# Altium schematic sheet 3V3 voltage regulato.SchDoc
size A4
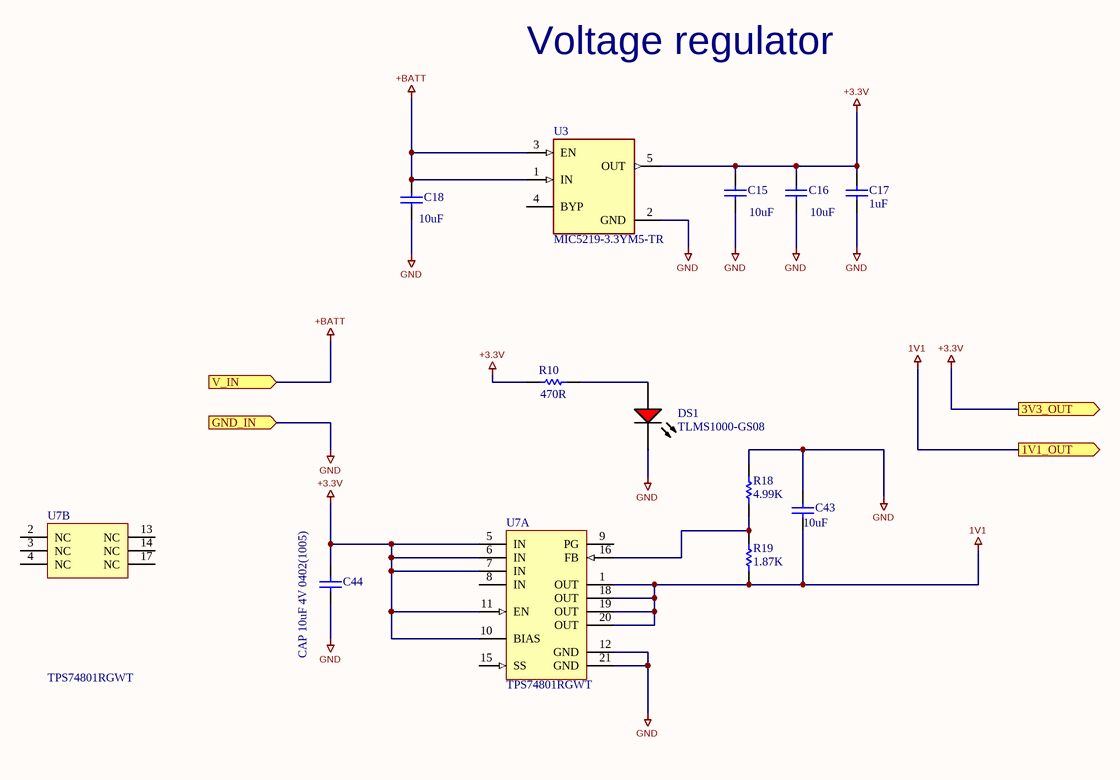
[diagram p0: 3V3 voltage regulato.SchDoc]

## Parts
C15  10uF  [CAPC1608X90X35NL10T15]
C16  10uF  [CAPC1608X90X35NL10T15]
C17  1uF  [CAPC1608X90X35LL10T15]
C18  10uF  [CAPC1608X90X35NL10T15]
C43  10uF  [CAPC0402(1005)60_L]
C44  CAP 10uF 4V 0402(1005)  [CAPC0402(1005)60_L]
DS1  TLMS1000-GS08  [VISH-TLMS1000_V]
R10  470R  [RESC1608X55X25LL10T15]
R18  4.99K  [RESC0402(1005)_N]
R19  1.87K  [RESC0402(1005)_N]
U3  MIC5219-3.3YM5-TR  [FP-SOT23-5LD-PL-1-IPC_C]
U7  TPS74801RGWT  [RGW0020A_V]  (parts A,B of 2)

## Ports
1V1_OUT (out), 3V3_OUT (out), GND_IN (in), V_IN (in)

## Nets
1V1: C43.1 R19.1 U7.1(OUT) U7.18(OUT) U7.19(OUT) U7.20(OUT) ; port 1V1_OUT
+3.3V: C15.2 C16.2 C17.2 C44.2 R10.1 U3.5(OUT) U7.5(IN) U7.6(IN) U7.7(IN) U7.10(BIAS) U7.11(EN) ; port 3V3_OUT
+BATT: C18.2 U3.1(IN) U3.3(EN) ; port V_IN
GND: C15.1 C16.1 C17.1 C18.1 C43.2 C44.1 DS1.2(K) R18.2 U3.2(GND) U7.12(GND) U7.21(GND) ; port GND_IN
NetDS1_1: DS1.1(A) R10.2
NetR18_1: R18.1 R19.2 U7.16(FB)

Not connected (* = marked no-connect by the designer): U3 4(BYP); U7 2(NC) 3(NC) 4(NC) 8(IN) 9(PG) 13(NC) 14(NC) 15(SS) 17(NC)

## Notes on the sheet
- Voltage regulator

## Library data of the parts
C15 C16 C18 = CMP-2006-02792-1: Part Number: GRM188R60J106ME47D; Manufacturer: Murata
C17 = CMP-2006-02459-1: Manufacturer: Murata; Part Number: GRM188R61E105KA12D
C43 C44 = CMP-1034-02139-1: CAP 10uF 4V ±20% 0402 (1005 Metric) Thickness 0.6mm SMD; Tolerance: Â±20%; Case-EIA: 0402; Case-Metric: 1005; Value: 10uF; Technology: SMT; Max Thickness: 0.6 mm; Rated Voltage: 4 V
DS1 = CMP-2000-07254-1: Low Current LED, 40 mW, 1.8 V, -40 to 100 degC, 2-Pin SMD (0603), RoHS, Tape and Reel; Manufacturer: Vishay; Lens Shape: Rectangular; Automotive Qualification Standard: AEC-Q100; Wavelength Typ: 636nm; SVHC: ToBeAdvised; LED Colour: Red; Bulb Size: 1.6mmx0.8mm; Forward Voltage: 1.8V; Luminous Intensity: 4mcd; Forward Current If: 2mA; Viewing Angle: 80°; Datasheet Version: Rev. 1.7, 02/2011; Datasheet URL: https://datasheet.ciiva.com/5798/1698881-5798337.pdf; LED Mounting: SMD; Packaging: CutTape; Package Reference: TLMS1000; Manufacturer URL: http://www.vishay.com/; Mounting Technology: SurfaceMount; Product Range: -; Package Description: 2-Pin Surface Mount Device, Body 1.6 x 0.8 mm; MSL: MSL2-1year
R10 = CMP-1659-00035-1: General Purpose Chip Resistor, 470 Ohm, +/- 1%, -55 to 155 degC, 0603 (1608 Metric), RoHS, Tape and Reel; Impedance: 50 Ohm; Fastening Type: Snap; Min Operating Temperature: -40 degC; Length: 3 mm; PackageReference: 0603; Contact Material: Brass; Max Operating Temperature: 90 degC; ComponentLink2URL: https://datasheet.ciiva.com/11808/0900766b80f96399-11808177.pdf; Packaging: Tape and Reel; DatasheetVersion: Rev. 4, 04/2009; Contact Plating: Gold; Radiation Hardening: No; Height: 1.25 mm; Resistance: 50 Ohm; RoHSCompliant: true; ComponentLink2Description: Datasheet; Package Quantity: 2500; ComponentLink1URL: http://www.yageo.com/; Width: 3.1 mm; Mount: Surface Mount; PackageDescription: 2-Pin Surface Mount Device, Body 1.6 x 0.8 mm; ComponentLink1Description: Manufacturer URL
R18 R19 = CMP-1011-00001-1: Jumper 0402 (1005 Metric); Tolerance: None; Case-Metric: 1005; Case-EIA: 0402; Value: 0.00 Ohm; Power: None; Technology: SMT
U3 = CMP-06324-000027-1: IC REG LINEAR 3.3V 500MA SOT23-5; Dropout Voltage: 350mV; Output Type: Fixed; Number of Regulators: 1; Max Input Voltage: 12V; Min Input Voltage: 2.5V; Min Operating Temperature: -40°C; Nominal Output Voltage: 3.3V; Output Voltage: 3.3V; Packaging: Cut Tape; Mount: Surface Mount; Number of Pins: 5; Case/Package: SOT-23-5; Lead Free: Lead Free; Max Operating Temperature: 125°C; REACH SVHC: No SVHC; Output Current: 500mA
U7 = CMP-0395-01394-2: Single Output LDO, 1.5 A, Adjustable 0.8 to 3.6 V Output, 0.8 to 5.5 V Input, with Programmable Soft Start, 20-pin VQFN (RGW), -40 to 125 degC, Green (RoHS & no Sb/Br); Manufacturer: Texas Instruments; Vout Adj(Min)(V): 0.8; Vout Adj(Max)(V): 3.6; Iout(Max)(A): 1.5; Iq(Typ)(mA): 1; Power Good: TRUE; Accuracy(%): 2; Vdo(Typ)(mV): 60; Vin(Max)(V): 5.5; SubFamily: Single Channel LDO; Rating: Catalog; ComponentLink2Description: Datasheet; ComponentLink1URL: http://www.ti.com/; PackageDescription: 20-Pin Plastic Quad Flat No-Pin, 5 x 5 mm Body, 0.65 mm Pitch, 3.15 x 3.15 mm Exposed Pad; ComponentLink3Description: Package Specification; Code_JEDEC: MO-220; Vin(Min)(V): 0.8; PartNumber: TPS74801RGWT; ComponentLink4URL: Samples URL:http://www.ti.com/product/tps74801#samples; ComponentLink1Description: Manufacturer URL; PackageReference: RGW0020A; ComponentLink2URL: http://www.ti.com/general/docs/lit/getliterature.tsp?genericPartNumber=TPS74801&fileType=pdf; Mounting Technology: Surface Mount; ComponentLink4Description: URL Link1; DatasheetVersion: SBVS074J; ComponentLink3URL: http://www.ti.com/litv/pdf/mpqf122b; Eco-Plan: Green (RoHS & no Sb/Br)